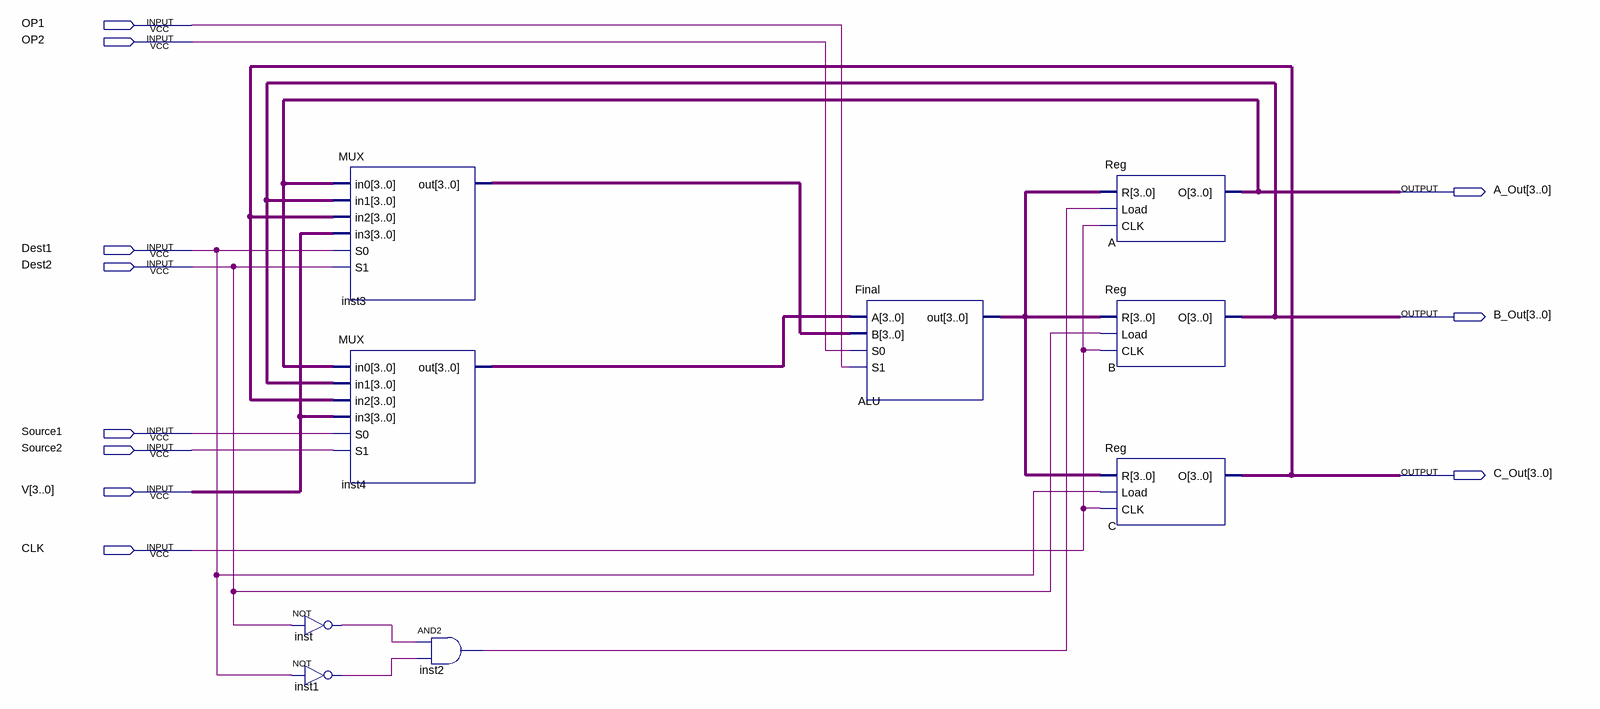
[diagram p0: schematic sheet]
// Quartus schematic EU.bdf as structural Verilog: 9 symbols, 11 pins
module EU (
  input  OP1,
  input  OP2,
  input  Dest1,
  input  Dest2,
  input  Source1,
  input  Source2,
  input  [3:0] V,
  input  CLK,
  output [3:0] A_Out,
  output [3:0] B_Out,
  output [3:0] C_Out
);

  wire inst1_out, inst2_out, inst_out;
  wire [3:0] ALU_out, inst3_out, inst4_out;

  MUX inst3 (.in0(A_Out), .in1(B_Out), .in2(C_Out), .in3(V), .S0(Dest1), .S1(Dest2), .out(inst3_out));
  MUX inst4 (.in0(A_Out), .in1(B_Out), .in2(C_Out), .in3(V), .S0(Source1), .S1(Source2), .out(inst4_out));
  not inst (inst_out, Dest2);
  not inst1 (inst1_out, Dest1);
  and inst2 (inst2_out, inst_out, inst1_out);
  Final ALU (.A(inst4_out), .B(inst3_out), .S0(OP2), .S1(OP1), .out(ALU_out));
  Reg A (.R(ALU_out), .Load(inst2_out), .CLK(CLK), .O(A_Out));
  Reg B (.R(ALU_out), .Load(Dest2), .CLK(CLK), .O(B_Out));
  Reg C (.R(ALU_out), .Load(Dest1), .CLK(CLK), .O(C_Out));
endmodule
